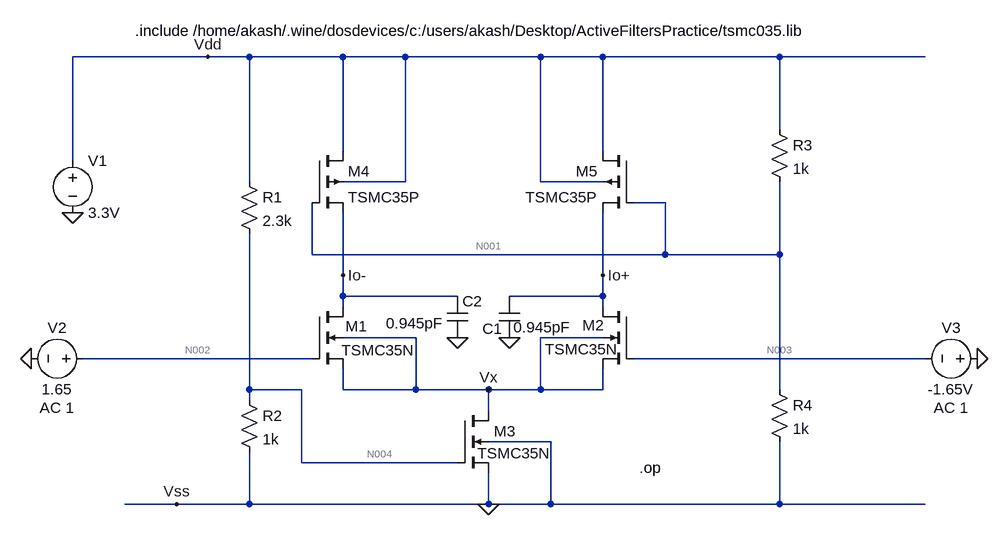
[diagram p0: schematic Final_Transconductor.asc]
Final_Transconductor.asc, the LTspice schematic file:
Version 4
SHEET 1 1012 876
WIRE -192 32 -400 32
WIRE -128 32 -192 32
WIRE 16 32 -128 32
WIRE 112 32 16 32
WIRE 320 32 112 32
WIRE 416 32 320 32
WIRE 688 32 416 32
WIRE 912 32 688 32
WIRE 688 144 688 32
WIRE 16 176 16 32
WIRE 416 176 416 32
WIRE -400 192 -400 32
WIRE -128 224 -128 32
WIRE 112 224 112 32
WIRE 112 224 16 224
WIRE 320 224 320 32
WIRE 416 224 320 224
WIRE 512 256 464 256
WIRE -32 336 -32 256
WIRE 512 336 512 256
WIRE 512 336 -32 336
WIRE 688 336 688 224
WIRE 688 336 512 336
WIRE 16 368 16 272
WIRE 416 368 416 272
WIRE 16 400 16 368
WIRE 192 400 16 400
WIRE 416 400 416 368
WIRE 416 400 272 400
WIRE 16 416 16 400
WIRE 416 416 416 400
WIRE 128 464 16 464
WIRE 416 464 320 464
WIRE -32 496 -384 496
WIRE 912 496 464 496
WIRE -128 544 -128 304
WIRE -48 544 -128 544
WIRE 16 544 16 512
WIRE 128 544 128 464
WIRE 128 544 16 544
WIRE 240 544 128 544
WIRE 320 544 320 464
WIRE 320 544 240 544
WIRE 416 544 416 512
WIRE 416 544 320 544
WIRE 688 544 688 336
WIRE -128 560 -128 544
WIRE 240 576 240 544
WIRE 336 624 240 624
WIRE -48 656 -48 544
WIRE 192 656 -48 656
WIRE -240 720 -320 720
WIRE -128 720 -128 640
WIRE -128 720 -240 720
WIRE 240 720 240 672
WIRE 240 720 -128 720
WIRE 336 720 336 624
WIRE 336 720 240 720
WIRE 688 720 688 624
WIRE 688 720 336 720
WIRE 912 720 688 720
FLAG -400 272 0
FLAG 240 720 0
FLAG -464 496 0
FLAG 992 496 0
FLAG 240 544 Vx
FLAG 416 368 Io+
FLAG 16 368 Io-
FLAG -192 32 Vdd
FLAG -240 720 Vss
FLAG 192 464 0
FLAG 272 464 0
SYMBOL voltage -400 176 R0
SYMATTR InstName V1
SYMATTR Value 3.3V
SYMBOL nmos4 -32 416 R0
WINDOW 3 46 67 Left 2
WINDOW 0 52 30 Left 2
SYMATTR Value TSMC35N
SYMATTR InstName M1
SYMATTR Value2 l=0.5u w=55u m=2
SYMBOL nmos4 464 416 M0
WINDOW 3 25 66 Left 2
WINDOW 0 46 29 Left 2
SYMATTR Value TSMC35N
SYMATTR InstName M2
SYMATTR Value2 l=0.5u w=55u m=2
SYMBOL nmos4 192 576 R0
WINDOW 3 31 66 Left 2
SYMATTR Value TSMC35N
SYMATTR InstName M3
SYMATTR Value2 l=0.5u w=12.2093u m=2
SYMBOL pmos4 -32 176 R0
SYMATTR InstName M4
SYMATTR Value TSMC35P
SYMATTR Value2 l=0.5u w=2u m=2
SYMBOL pmos4 464 176 M0
SYMATTR InstName M5
SYMATTR Value TSMC35P
SYMATTR Value2 l=0.5u w=2u m=2
SYMBOL voltage -368 496 R90
WINDOW 0 -32 56 VBottom 2
WINDOW 3 32 56 VTop 2
WINDOW 123 60 56 VTop 2
WINDOW 39 0 0 Left 0
SYMATTR InstName V2
SYMATTR Value 1.65
SYMATTR Value2 AC 1
SYMBOL voltage 1008 496 R90
WINDOW 0 -32 56 VBottom 2
WINDOW 3 32 56 VTop 2
WINDOW 123 60 56 VTop 2
WINDOW 39 0 0 Left 0
SYMATTR InstName V3
SYMATTR Value -1.65V
SYMATTR Value2 AC 1
SYMBOL res -144 208 R0
SYMATTR InstName R1
SYMATTR Value 2.3k
SYMBOL res -144 544 R0
SYMATTR InstName R2
SYMATTR Value 1k
SYMBOL res 672 128 R0
SYMATTR InstName R3
SYMATTR Value 1k
SYMBOL res 672 528 R0
SYMATTR InstName R4
SYMATTR Value 1k
SYMBOL cap 256 400 R0
WINDOW 0 -25 50 Left 2
WINDOW 3 22 48 Left 2
SYMATTR InstName C1
SYMATTR Value 0.945pF
SYMBOL cap 176 400 R0
WINDOW 3 -94 42 Left 2
SYMATTR Value 0.945pF
SYMATTR InstName C2
TEXT -304 -8 Left 2 !.include /home/akash/.wine/dosdevices/c:/users/akash/Desktop/ActiveFiltersPractice/tsmc035.lib
TEXT 472 664 Left 2 !.op

The netlist it stands for:
* Final_Transconductor.asc
V1 Vdd 0 3.3V
M1 Io- N002 Vx Vx TSMC35N l=0.5u w=55u m=2
M2 Io+ N003 Vx Vx TSMC35N l=0.5u w=55u m=2
M3 Vx N004 0 0 TSMC35N l=0.5u w=12.2093u m=2
M4 Vdd N001 Io- Vdd TSMC35P l=0.5u w=2u m=2
M5 Vdd N001 Io+ Vdd TSMC35P l=0.5u w=2u m=2
V2 N002 0 1.65 AC 1
V3 0 N003 -1.65V AC 1
R1 Vdd N004 2.3k
R2 N004 0 1k
R3 Vdd N001 1k
R4 N001 0 1k
C1 Io+ 0 0.945pF
C2 Io- 0 0.945pF
.model NMOS NMOS
.model PMOS PMOS
.lib standard.mos
.include /home/akash/.wine/dosdevices/c:/users/akash/Desktop/ActiveFiltersPractice/tsmc035.lib
.op
.backanno
.end

* Results of the author's LTspice run, read from the files saved beside the schematic
* Operating Point:
*   V(vdd) = 3.3 V
*   V(io-) = 1.65 V
*   V(n002) = 1.65 V
*   V(vx) = 828.6 mV
*   V(io+) = 1.65 V
*   V(n003) = 1.65 V
*   V(n004) = 1 V
*   V(n001) = 1.65 V
*   Id(M5) = 104.1 µA
*   Ig(M5) = 0 A
*   Ib(M5) = 3.32 pA
*   Is(M5) = -104.1 µA
*   Id(M4) = 104.1 µA
*   Ig(M4) = 0 A
*   Ib(M4) = 3.32 pA
*   Is(M4) = -104.1 µA
*   Id(M3) = 208.2 µA
*   Ig(M3) = 0 A
*   Ib(M3) = -1.677 pA
*   Is(M3) = -208.2 µA
*   Id(M2) = 104.1 µA
*   Ig(M2) = 0 A
*   Ib(M2) = -1.663 pA
*   Is(M2) = -104.1 µA
*   Id(M1) = 104.1 µA
*   Ig(M1) = 0 A
*   Ib(M1) = -1.663 pA
*   Is(M1) = -104.1 µA
*   I(C2) = 0 A
*   I(C1) = 0 A
*   I(R4) = 1.65 mA
*   I(R3) = 1.65 mA
*   I(R2) = 1 mA
*   I(R1) = 1 mA
*   I(V3) = 0 A
*   I(V2) = 0 A
*   I(V1) = -2.858 mA
* From the log:
*   Semiconductor Device Operating Points:
*                           --- BSIM3 MOSFETS ---
*   Name:        m5          m4          m3          m2          m1
*   Model:     tsmc35p     tsmc35p     tsmc35n     tsmc35n     tsmc35n
*   Id:        1.04e-04    1.04e-04    2.08e-04    1.04e-04    1.04e-04
*   Vgs:      -8.39e-05   -8.39e-05    1.00e+00    8.21e-01    8.21e-01
*   Vds:       1.65e+00    1.65e+00    8.29e-01    8.21e-01    8.21e-01
*   Vbs:       1.65e+00    1.65e+00    0.00e+00    0.00e+00    0.00e+00
*   Vth:      -8.05e-01   -8.05e-01    7.53e-01    7.51e-01    7.51e-01
*   Vdsat:    -6.45e-01   -6.45e-01    1.86e-01    7.86e-02    7.86e-02
*   Gm:        2.03e-04    2.03e-04    1.80e-03    1.71e-03    1.71e-03
*   Gds:       6.20e-06    6.20e-06    3.25e-05    2.60e-05    2.60e-05
*   Gmb        3.73e-05    3.73e-05    4.47e-04    4.49e-04    4.49e-04
*   Cbd:       0.00e+00    0.00e+00    0.00e+00    0.00e+00    0.00e+00
*   Cbs:       0.00e+00    0.00e+00    0.00e+00    0.00e+00    0.00e+00
*   Cgsov:     7.31e-16    7.31e-16    6.65e-15    3.05e-14    3.05e-14
*   Cgdov:     7.31e-16    7.31e-16    6.65e-15    3.05e-14    3.05e-14
*   Cgbov:     1.00e-16    1.00e-16    9.06e-17    9.06e-17    9.06e-17
*   dQgdVgb:   7.66e-15    7.66e-15    5.19e-14    2.15e-13    2.15e-13
*   dQgdVdb:  -6.71e-16   -6.71e-16   -6.44e-15   -2.97e-14   -2.97e-14
*   dQgdVsb:  -6.63e-15   -6.63e-15   -4.15e-14   -1.59e-13   -1.59e-13
*   dQddVgb:  -3.24e-15   -3.24e-15   -2.23e-14   -8.87e-14   -8.87e-14
*   dQddVdb:   6.99e-16    6.99e-16    6.53e-15    3.00e-14    3.00e-14
*   dQddVsb:   3.09e-15    3.09e-15    2.04e-14    7.63e-14    7.63e-14
*   dQbdVgb:  -1.17e-15   -1.17e-15   -7.28e-15   -3.72e-14   -3.72e-14
*   dQbdVdb:   4.04e-18    4.04e-18    3.43e-17    1.52e-16    1.52e-16
*   dQbdVsb:  -2.74e-16   -2.74e-16   -6.04e-15   -2.41e-14   -2.41e-14